# Altium schematic sheet Arduino_PMOD.SchDoc
size A3
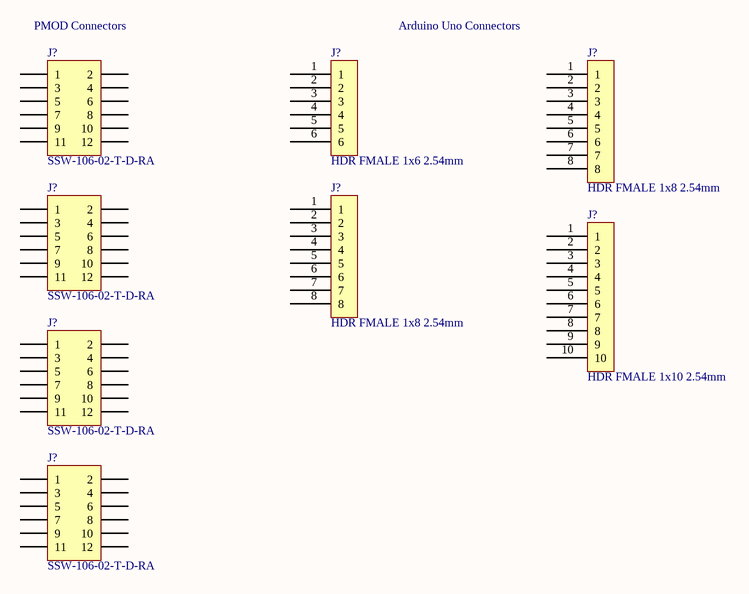
[diagram p0: Arduino_PMOD.SchDoc]

## Parts
(Parts that share a designator on the sheet are numbered #1, #2 ... from top to bottom, then left to right.)
J?#1  SSW-106-02-T-D-RA  [HDR2X6H]
J?#2  HDR FMALE 1x6 2.54mm  [Hdr_Female_1x6_2.54mm]
J?#3  HDR FMALE 1x8 2.54mm  [Hdr_Female_1x8_2.54mm]
J?#4  SSW-106-02-T-D-RA  [HDR2X6H]
J?#5  HDR FMALE 1x8 2.54mm  [Hdr_Female_1x8_2.54mm]
J?#6  HDR FMALE 1x10 2.54mm  [Hdr_Female_1x10_2.54mm]
J?#7  SSW-106-02-T-D-RA  [HDR2X6H]
J?#8  SSW-106-02-T-D-RA  [HDR2X6H]

## Nets

Not connected (* = marked no-connect by the designer): J?#1 1 2 3 4 5 6 7 8 9 10 11 12; J?#2 1 2 3 4 5 6; J?#3 1 2 3 4 5 6 7 8; J?#4 1 2 3 4 5 6 7 8 9 10 11 12; J?#5 1 2 3 4 5 6 7 8; J?#6 1 2 3 4 5 6 7 8 9 10; J?#7 1 2 3 4 5 6 7 8 9 10 11 12; J?#8 1 2 3 4 5 6 7 8 9 10 11 12

## Notes on the sheet
- (near J?#1) PMOD Connectors
- Arduino Uno Connectors

## Library data of the parts
J?#1 J?#4 J?#7 J?#8 = SSW-106-02-T-D-RA: CONN RCPT .100" 12PS DL R/A TIN; Manufacturer 1: Samtec Inc.; ComponentLink1Description: Datasheet; ComponentLink1URL: C:\Users\Public\Documents\Altium\AD16\Library\PDF\ssw-1xx-xx-xxx-x-xx-xxx-xx-mkt.pdf; Supplier 1: Digi-Key; Supplier Part Number 1: SAM10026-ND; Manufacturer Part Number 1: SSW-106-02-T-D-RA; Operating Temperature: -55°C ~ 105°C; Insulation Height: 0.195" (4.95mm)
J?#2 = M20-7820646: 06-WAY SIL VERT SOCKET L/FREE; Manufacturer 1: Harwin Inc; Connector Type: Receptacle; Number of Positions: 6; Number of Positions Loaded: All; Pitch: 0.100" (2.54mm); .Checked PCB: MM; Supplier 1: Digi-Key; Manufacturer Part Number 1: M20-7820646; RoHS: RoHS Compliant; Category: Connectors, Interconnects; Stock 1: 87; Pricing 1: 1=0.96, 38=0.79211, 76=0.75895, 114=0.72596, 266=0.66, 532=0.594, 1026=0.528, 2508=0.4785 (USD); Packaging: Tube; Contact Type: Female Socket; Number of Rows: 1; Row Spacing: -; Mounting Type: Through Hole; Termination: Solder; Fastening Type: -; Features: -; Contact Finish: Tin; Contact Finish Thickness: -; Color: Black; ComponentLink1URL: http://harwin.com/includes/pdfs/M20-782.pdf; ComponentLink1Description: http://harwin.com/includes/pdfs/M20-782.pdf; Supplier Part Number 1: 952-1809-ND; .Checked SCH: MM; .Creator: MM
J?#3 J?#5 = M20-7820842: 08-WAY SIL VERT SOCKET L/FREE; Manufacturer 1: Harwin Inc; Connector Type: Receptacle; Number of Positions: 8; Number of Positions Loaded: All; Pitch: 0.100" (2.54mm); .Creator: MM; .Checked PCB: RF; Supplier 1: Digi-Key; Manufacturer Part Number 1: M20-7820842; RoHS: RoHS Compliant; Category: Connectors, Interconnects; Stock 1: 2070; Pricing 1: 1=1.1, 29=0.91207, 58=0.87397, 116=0.83603, 261=0.76, 522=0.684, 1015=0.608, 2523=0.551 (USD); Packaging: Tube; Contact Type: Female Socket; Number of Rows: 1; Row Spacing: -; Mounting Type: Through Hole; Termination: Solder; Fastening Type: -; Features: -; Contact Finish: Gold; Contact Finish Thickness: Flash; Color: Black; ComponentLink1URL: http://harwin.com/includes/pdfs/M20-782.pdf; ComponentLink1Description: http://harwin.com/includes/pdfs/M20-782.pdf; Supplier Part Number 1: 952-1823-ND; .Checked SCH: RF
J?#6 = M20-7821046: 10-WAY SIL VERT SOCKET L/FREE; Manufacturer 1: Harwin Inc; Connector Type: Receptacle; Number of Positions: 10; Number of Positions Loaded: All; Pitch: 0.100" (2.54mm); .Creator: MM; .Checked PCB: RF; Supplier 1: Digi-Key; Manufacturer Part Number 1: M20-7821046; RoHS: RoHS Compliant; Category: Connectors, Interconnects; Stock 1: 214; Pricing 1: 1=1.28, 23=1.12217, 46=1.05609, 69=1.01203, 115=0.968, 253=0.88, 506=0.792, 1012=0.704, 2507=0.638 (USD); Packaging: Tube; Contact Type: Female Socket; Number of Rows: 1; Row Spacing: -; Mounting Type: Through Hole; Termination: Solder; Fastening Type: -; Features: -; Contact Finish: Tin; Contact Finish Thickness: -; Color: Black; ComponentLink1URL: http://harwin.com/includes/pdfs/M20-782.pdf; ComponentLink1Description: http://harwin.com/includes/pdfs/M20-782.pdf; Supplier Part Number 1: 952-1847-ND; .Checked SCH: RF